# EasyEDA Pro project ProPrj_ESP-ARGB_2026-06-01.epro

# Schematic ESP-ARGB
Board Name: ESP-ARGB V1; Create Date: 2026-05-13; Page Name: P1; Project Name: ESP-ARGB; Schematic Name: ESP-ARGB; Update Date: 2026-05-25; Page Size: A4; Version: V1.0
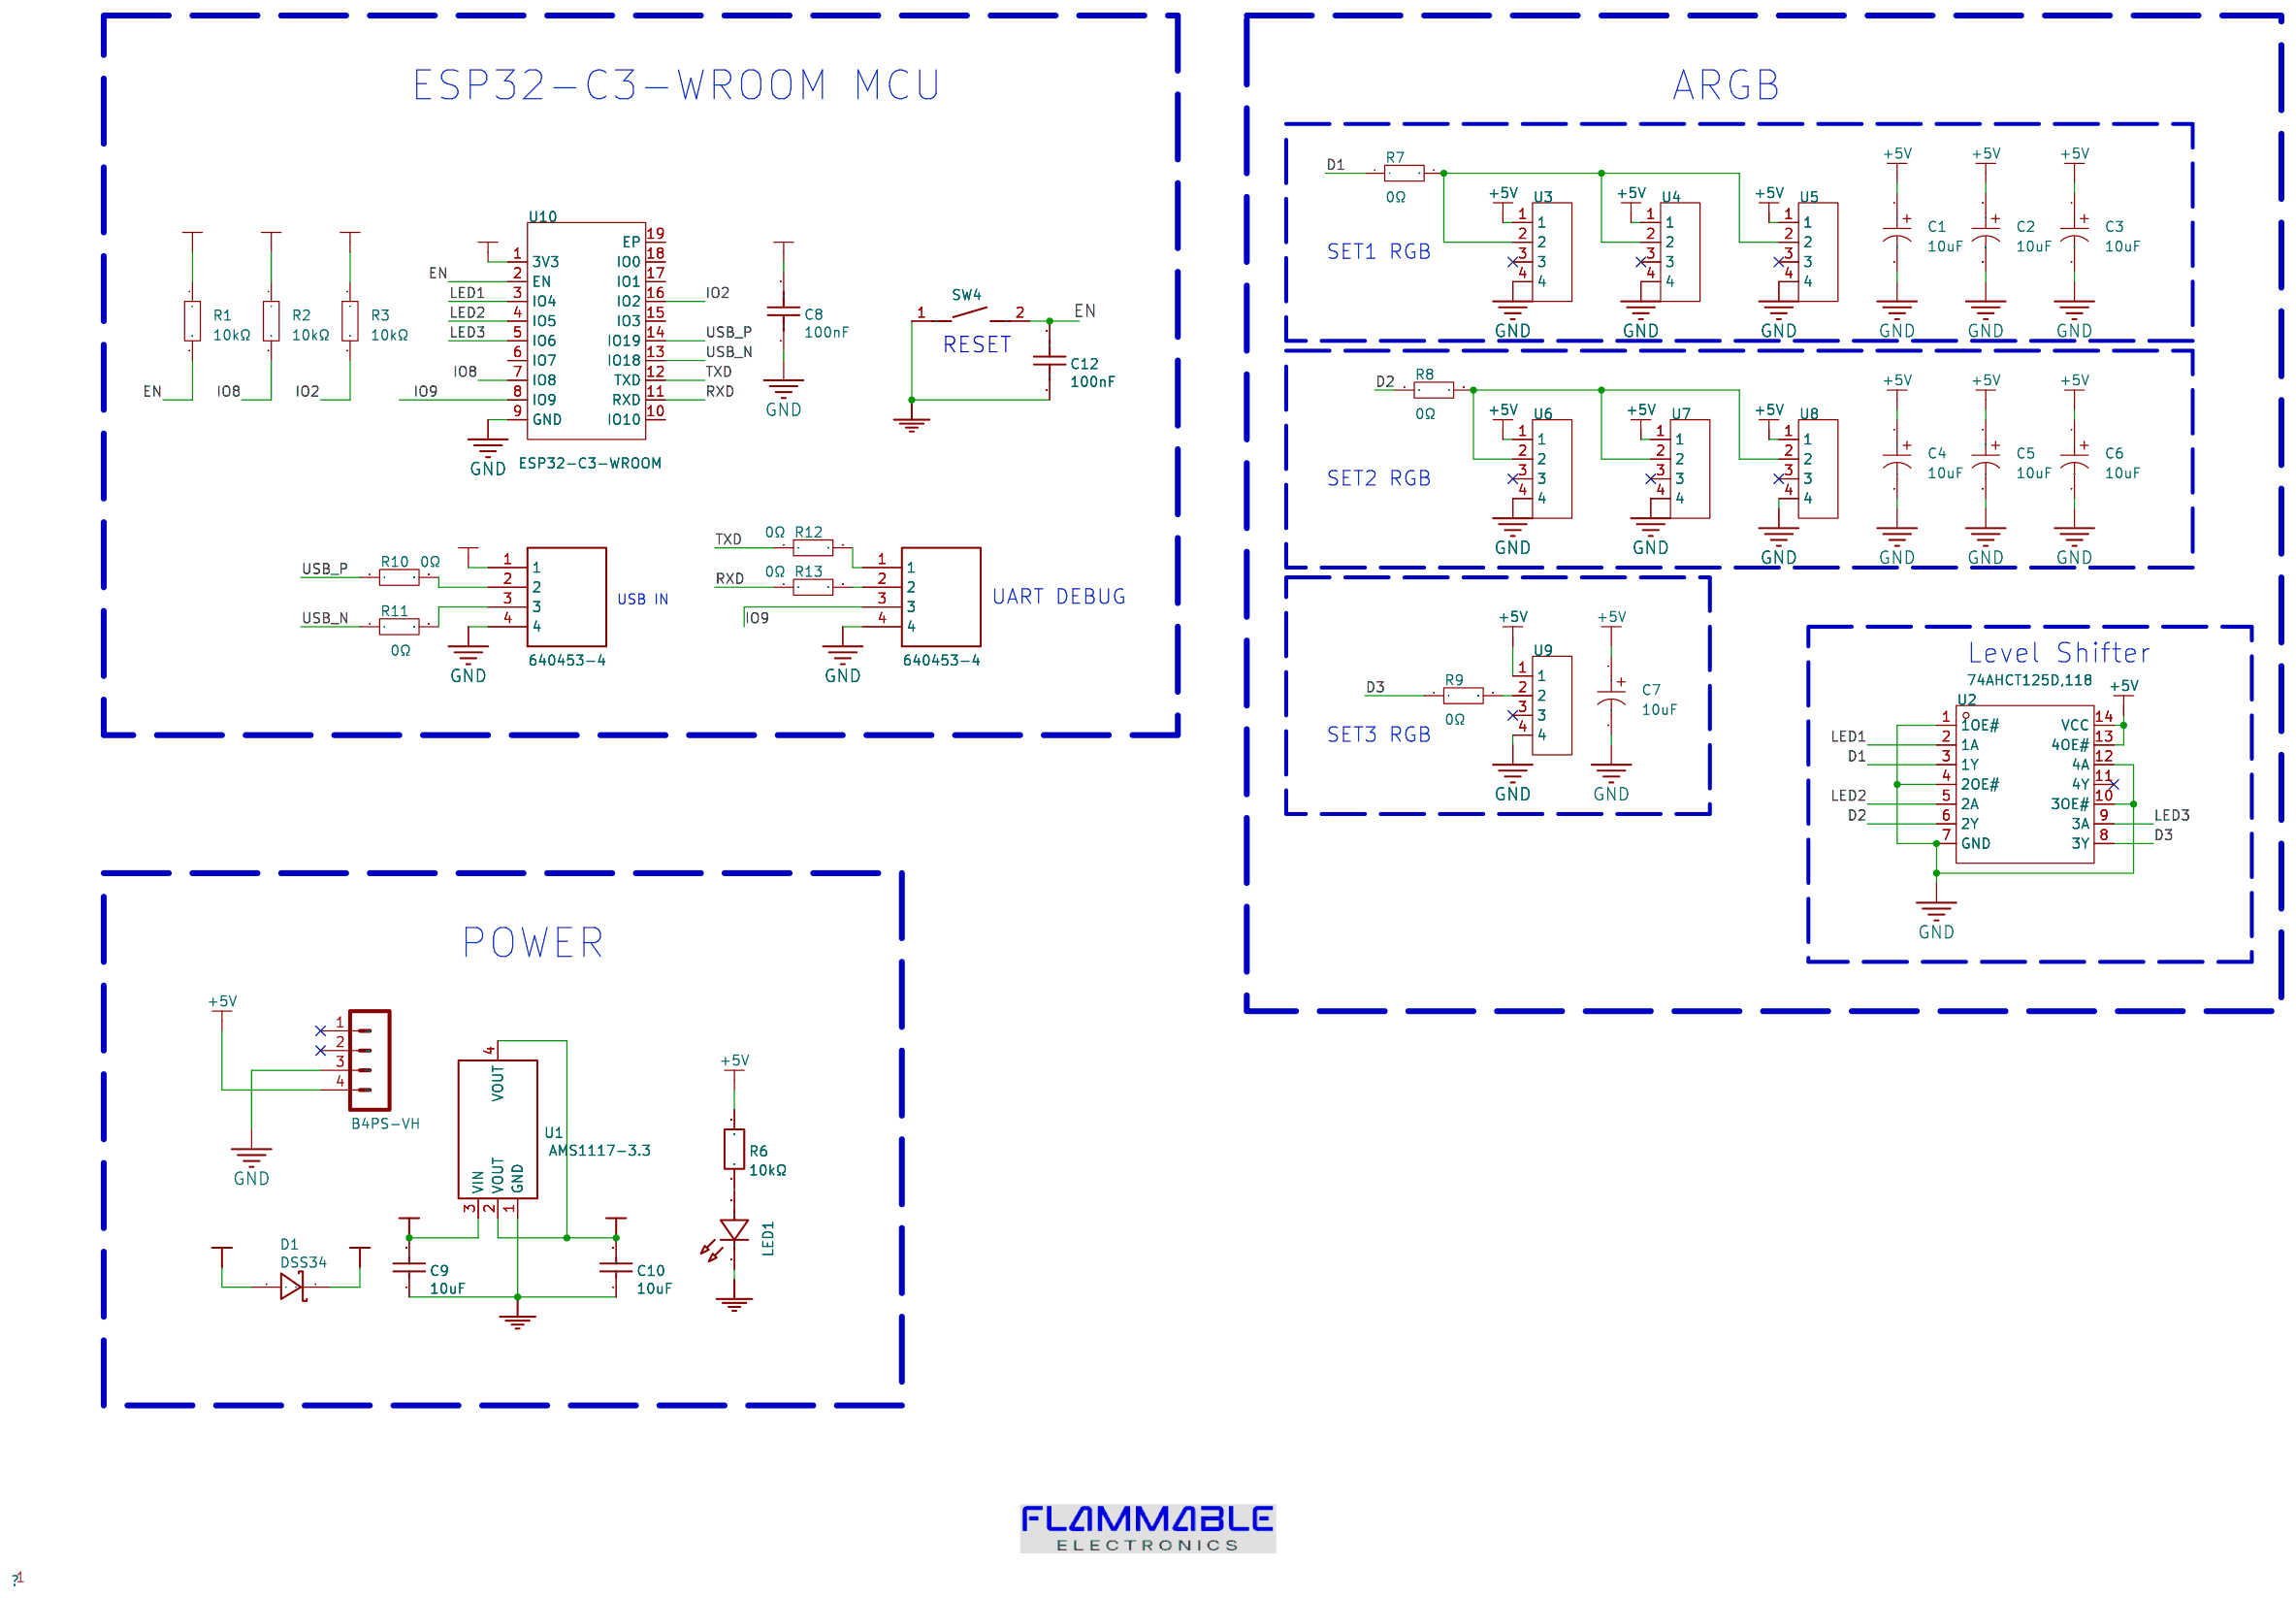
[diagram p0: schematic sheet]

## Parts
C1  10uF  [CAP-SMD_BD4.0-L4.3-W4.3-LS5.0-FD]
C2  10uF  [CAP-SMD_BD4.0-L4.3-W4.3-LS5.0-FD]
C3  10uF  [CAP-SMD_BD4.0-L4.3-W4.3-LS5.0-FD]
C4  10uF  [CAP-SMD_BD4.0-L4.3-W4.3-LS5.0-FD]
C5  10uF  [CAP-SMD_BD4.0-L4.3-W4.3-LS5.0-FD]
C6  10uF  [CAP-SMD_BD4.0-L4.3-W4.3-LS5.0-FD]
C7  10uF  [CAP-SMD_BD4.0-L4.3-W4.3-LS5.0-FD]
C8  100nF  [C0805]
C9  10uF  [C0805]
C10  10uF  [C0805]
C12  100nF  [C0805]
D1  DSS34  [SOD-123_L2.8-W1.8-LS3.7-RD]
LED1  SF-RED  [LED0805-RD_RED]
R1  10kΩ  [R0805]
R2  10kΩ  [R0805]
R3  10kΩ  [R0805]
R6  10kΩ  [R0805]
R7  0Ω  [R0805]
R8  0Ω  [R0805]
R9  0Ω  [R0805]
R10  0Ω  [R0805]
R11  0Ω  [R0805]
R12  0Ω  [R0805]
R13  0Ω  [R0805]
SW4  TS-1088-AR02016  [SW-SMD_L3.9-W3.0-P4.45]
U1  AMS1117-3.3  [SOT-223-3_L6.5-W3.4-P2.30-LS7.0-BR]
U2  74AHCT125D,118  [SOP-14_L8.6-W3.9-P1.27-LS6.0-BL]
U3  P125-1104A0BR138A1  [HDR-TH_4P-P2.54-H-M-W10.3]
U4  P125-1104A0BR138A1  [HDR-TH_4P-P2.54-H-M-W10.3]
U5  P125-1104A0BR138A1  [HDR-TH_4P-P2.54-H-M-W10.3]
U6  P125-1104A0BR138A1  [HDR-TH_4P-P2.54-H-M-W10.3]
U7  P125-1104A0BR138A1  [HDR-TH_4P-P2.54-H-M-W10.3]
U8  P125-1104A0BR138A1  [HDR-TH_4P-P2.54-H-M-W10.3]
U9  P125-1104A0BR138A1  [HDR-TH_4P-P2.54-H-M-W10.3]
U10  ESP32-C3-WROOM  [BULETM-SMD_ESPRESSIF_ESP32-C3-WROOM-02-N4-4MB]
U11  640453-4  [TE_640453-4]
U12  640453-4  [TE_640453-4]
X1  B4PS-VH  [B4PS-VH]

## Library data of the parts
C1-C7 = RVT1E100M0405 10UF 25V: Capacitance:10uF Tolerance:±20% Tolerance:±20% Voltage Rating:25V Ripple Current:15mA@120Hz Equivalent Series Resistance(ESR):- Diameter:4mm Height - Seated (Max):5.4mm Lifetime:2800hrs@105℃ Operating Temperature:-55℃~+105℃ Operating Temperature:-55℃~+105; LCSC Part Name: 10uF ±20% 25V; Supplier Part: C970655; Manufacturer: DMBJ(振宝佳); Supplier Footprint: SMD,D4xL5.4mm; JLCPCB Part Class: Extended Part; Datasheet: https://item.szlcsc.com/datasheet/RVT1E100M0405%252010UF%252025V/1060383.html; Supplier: LCSC; Tolerance: ±20%; Voltage Rating: 25V; Ripple Current: 15mA@120Hz; Diameter: 4mm; Height - Seated (Max): 5.4mm; Lifetime: 2800hrs@105℃; Operating Temperature: -55℃~+105℃
C8 C12 = 100nF: Supplier: LCSC; Manufacturer: TDK; Manufacturer Part: C2012X7R1H104KT0J0N; Supplier Part: C76644; JLCPCB Part Class: Extended Part; nameAlias: Value; spicePre: C; spiceSymbolName: C2012X7R1H104KT0J0N
C9 C10 = 10uF: Supplier: LCSC; Manufacturer Part: CL21A106KOQNNNE; Manufacturer: SAMSUNG(三星); Supplier Part: C1713; JLCPCB Part Class: Extended Part; nameAlias: Value; spicePre: C; spiceSymbolName: CL21A106KOQNNNE
D1 = DSS34: Supplier: LCSC; Manufacturer: 星海; Supplier Part: C84632; JLCPCB Part Class: Extended Part; spicePre: D
LED1 = SF-RED: Supplier: LCSC; Supplier Part: C9900020303; Manufacturer: null; Manufacturer Part: 0805 SF-Red; JLCPCB Part Class: Extended Part; Contributor: lcsc; spicePre: U; spiceSymbolName: 0805 SF-RED
R1-R3 = 0805W8F1002T5E: Type:Thick Film Resistor Resistance:10kΩ Tolerance:±1% Tolerance:±1% Power(Watts):125mW Voltage-Supply(Max):150V Temperature Coefficient:±100ppm/℃ Temperature Coefficient:±100ppm/℃ Operating Temperature:-55℃~+155℃ Operating Temperature:-55℃~+155℃; LCSC Part Name: 10kΩ ±1% 125mW 厚膜电阻; Supplier Part: C17414; Manufacturer: UNI-ROYAL(厚声); Supplier Footprint: 0805; Datasheet: https://item.szlcsc.com/datasheet/0805W8F1002T5E/18102.html; Supplier: LCSC; Type: Thick Film Resistor; Tolerance: ±1%; Power(Watts): 125mW; Voltage-Supply(Max): 150V; Temperature Coefficient: ±100ppm/℃; Operating Temperature: -55℃~+155℃
R6 = 10kΩ: Supplier: LCSC; Supplier Part: C2076274; Manufacturer: VISHAY(威世); Manufacturer Part: TNPW080510K0BETA; JLCPCB Part Class: Extended Part; nameAlias: Value; Contributor: lcsc; spicePre: R; spiceSymbolName: TNPW080510K0BETA
R7-R13 = 0805W8F0000T5E_C17477: Type:Thick Film Resistor Resistance:0Ω Tolerance:±1% Tolerance:±1% Power(Watts):125mW Voltage-Supply(Max):150V Temperature Coefficient:±800ppm/℃ Temperature Coefficient:±800ppm/℃ Operating Temperature:-55℃~+155℃ Operating Temperature:-55℃~+155℃; LCSC Part Name: 0Ω ±1% 125mW 厚膜电阻; Supplier Part: C17477; Manufacturer: UNI-ROYAL(厚声); Manufacturer Part: 0805W8F0000T5E; Supplier Footprint: 0805; Datasheet: https://item.szlcsc.com/datasheet/0805W8F0000T5E/18165.html; Supplier: LCSC; Type: Thick Film Resistor; Tolerance: ±1%; Power(Watts): 125mW; Voltage-Supply(Max): 150V; Temperature Coefficient: ±800ppm/℃; Operating Temperature: -55℃~+155℃
SW4 = TS-1088-AR02016: Supplier: LCSC; Supplier Part: C720477; Manufacturer: XUNPU(讯普); JLCPCB Part Class: Basic Part; Contributor: LCSC; spicePre: S
U1 = AMS1117-3.3: Supplier: LCSC; Manufacturer: AMS; Supplier Part: C6186; JLCPCB Part Class: Basic Part; sourceId: dwIGgezVh; timeStamp: 1476261164; spicePre: U
U2 = 74AHCT125D,118: Input type:Schmitt trigger output type:Tri-State Voltage - Supply:4.5V~5.5V Voltage - Supply:4.5V~5.5V Number of Elements:4 Number of Bits per Element:1 Channel Type:Unidirectional Current - Output Low(IOL):8mA Current - Output High(IOH):8mA Logic Family:; LCSC Part Name: 三态输出，四路缓冲器/线路驱动器; Supplier Part: C554502; Manufacturer: Nexperia(安世); Supplier Footprint: SOP-14; JLCPCB Part Class: Extended Part; Datasheet: https://item.szlcsc.com/datasheet/74AHCT125D%252C118/575616.html; Supplier: LCSC; Input type: Schmitt trigger; output type: Tri-State; Voltage - Supply: 4.5V~5.5V; Number of Elements: 4; Number of Bits per Element: 1; Channel Type: Unidirectional; Current - Output Low(IOL): 8mA; Current - Output High(IOH): 8mA; Logic Family: 74AHCT; Operating Temperature: -40℃~+125℃; Quiescent Current: 40uA; Propagation Delay: 4.3ns@5V,50pF
U3-U9 = P125-1104A0BR138A1: Pin Structure:1x4P Pitch:2.54mm Row Spacing:2.54mm Circluar Pins/Square Pins:Pin Header Mounting Type:Right Angle Number of Rows:1 Number of Pins:4P Current Rating:- Voltage Rating (Max):- Length of Mating Pin:6mm Insulation Height:2.5mm Length of End Con; LCSC Part Name: 1x4P 间距:2.54mm 方针 弯插; Supplier Part: C19190478; Manufacturer: Yxcon(宇熙精密); Supplier Footprint: 弯插,P=2.54mm; JLCPCB Part Class: Extended Part; Datasheet: https://item.szlcsc.com/datasheet/P125-1104A0BR138A1/20425800.html; Supplier: LCSC; Pin Structure: 1x4P; Pitch: 2.54mm; Row Spacing: 2.54mm; Circluar Pins/Square Pins: Pin Header; Mounting Type: Right Angle; Number of Rows: 1; Number of Pins: 4P; Length of Mating Pin: 6mm; Insulation Height: 2.5mm; Contact Material: Brass; Contact Plating: Gold; Operating Temperature: -40℃~+105℃; Color: Black
U10 = ESP32-C3-WROOM-02-N4_C2934560: Utilized IC / Part:ESP32-C3 Chip Wireless Standard:Bluetooth5.0 Interface Type:I2S；I2C；JTAG；UART；USB；SPI Frequency:2.4GHz Antenna Type:On-board PCB Antenna Output Power:20.5dBm Output Power:20.5dBm Voltage - Supply:3V~3.6V Voltage - Supply:3V~3.6V Receive; LCSC Part Name: 不带固件 2.4GHz Wi-Fi（802.11b/g/n）+ 蓝牙5模组; Supplier Part: C2934560; Manufacturer: ESPRESSIF(乐鑫); Manufacturer Part: ESP32-C3-WROOM-02-N4; Supplier Footprint: VFQFN-32-EP; Datasheet: https://item.szlcsc.com/datasheet/ESP32-C3-WROOM-02-N4/3281215.html; Supplier: LCSC; Utilized IC / Part: ESP32-C3 Chip; Wireless Standard: Bluetooth5.0; Interface Type: I2S；I2C；JTAG；UART；USB；SPI; Antenna Type: On-board PCB Antenna; Output Power: 20.5dBm; Voltage - Supply: 3V~3.6V; Receive  Current: 82mA; Send  Current: 345mA; Sensitivity: -105dBm; Operating Temperature: -40℃~+85℃
U11 U12 = 640453-4
X1 = B4PS-VH: MF: JST Sales; Package1: None; Price: None; SnapEDA_Link: https://www.snapeda.com/parts/B4PS-VH/JST/view-part/?ref=snap; Availability: In Stock; Check_prices: https://www.snapeda.com/parts/B4PS-VH/JST/view-part/?ref=eda

## Nets
+3.3V: C8.2 C10.2 R1.1 R2.1 R3.1 U1.2(VOUT) U1.4(VOUT) U10.1(3V3)
+5V: C1.1 C2.1 C3.1 C4.1 C5.1 C6.1 C7.1 C9.2 D1.1(K) R6.2 U1.3(VIN) U2.13(4OE#) U2.14(VCC) U3.1 U4.1 U5.1 U6.1 U7.1 U8.1 U9.1 X1.4
GND: C1.2 C2.2 C3.2 C4.2 C5.2 C6.2 C7.2 C8.1 C9.1 C10.1 C12.1 LED1.1(K) SW4.1 U1.1(GND) U2.1(1OE#) U2.4(2OE#) U2.7(GND) U2.10(3OE#) U2.12(4A) U3.4 U4.4 U5.4 U6.4 U7.4 U8.4 U9.4 U10.9(GND) U11.4 U12.4 X1.3
VBUS: D1.2(A) U11.1
D1: R7.1 U2.3(1Y)
D2: R8.1 U2.6(2Y)
D3: R9.1 U2.8(3Y)
EN: C12.2 R1.2 SW4.2 U10.2(EN)
IO2: R3.2 U10.16(IO2)
IO8: R2.2 U10.7(IO8)
IO9: U10.8(IO9) U12.3
LED1: U2.2(1A) U10.3(IO4)
LED2: U2.5(2A) U10.4(IO5)
LED3: U2.9(3A) U10.5(IO6)
RXD: R13.1 U10.11(RXD)
TXD: R12.1 U10.12(TXD)
USB_N: R11.1 U10.13(IO18)
USB_P: R10.1 U10.14(IO19)
$1N1605: R7.2 U3.2 U4.2 U5.2
$1N1629: R8.2 U6.2 U7.2 U8.2
$1N5231: LED1.2(A) R6.1
$1N5490: R9.2 U9.2
$1N5614: R11.2 U11.3
$1N5618: R10.2 U11.2
$1N5718: R12.2 U12.1
$1N5757: R13.2 U12.2

Not connected (* = marked no-connect by the designer): U2 11(4Y)*; U3 3*; U4 3*; U5 3*; U6 3*; U7 3*; U8 3*; U9 3*; U10 6(IO7) 10(IO10) 15(IO3) 17(IO1) 18(IO0) 19(EP); X1 1* 2*

## Notes on the sheet
- ESP32-C3-WROOM MCU
- ARGB
- SET1 RGB
- RESET
- SET2 RGB
- USB IN
- UART DEBUG
- Level Shifter
- SET3 RGB
- POWER

# Board PCB1
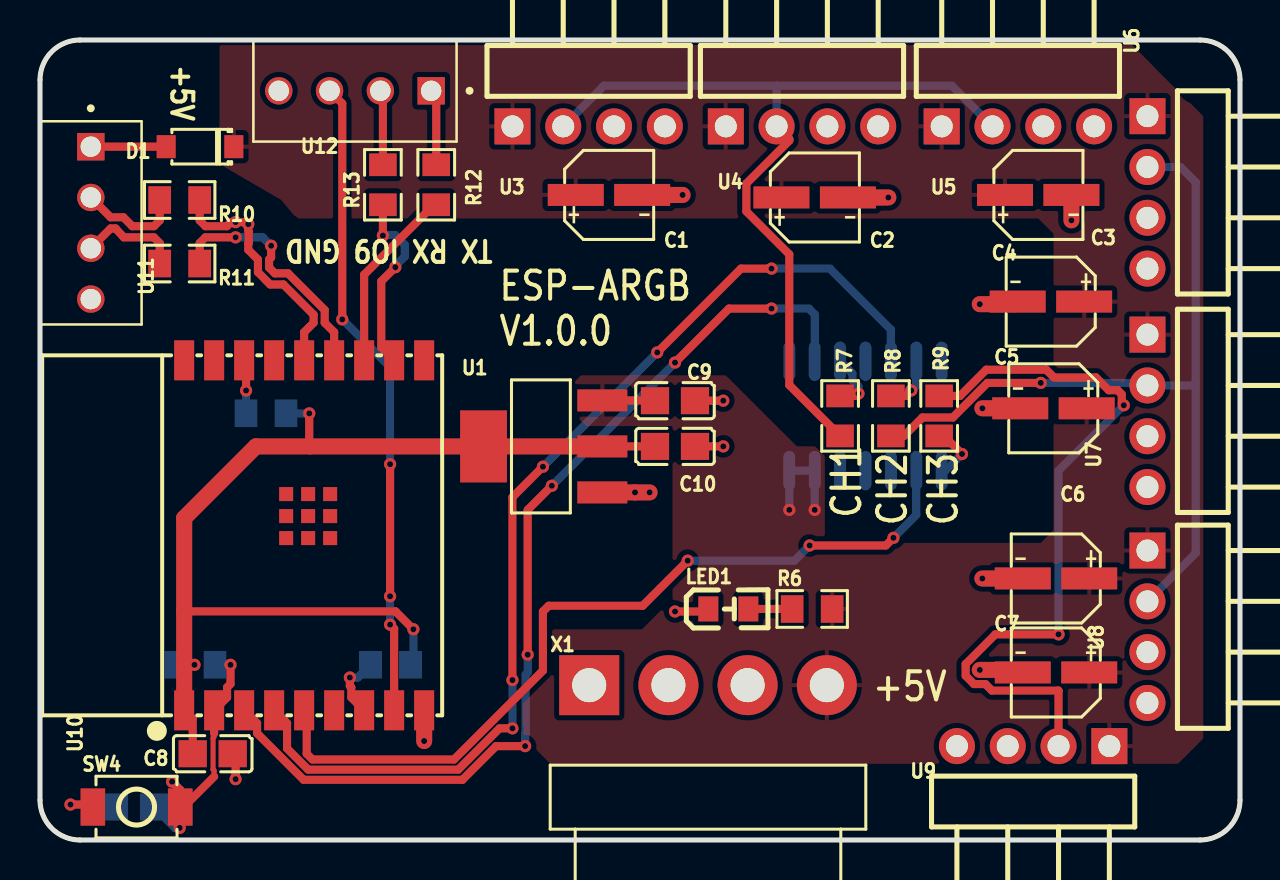
[diagram p1: board, top side]
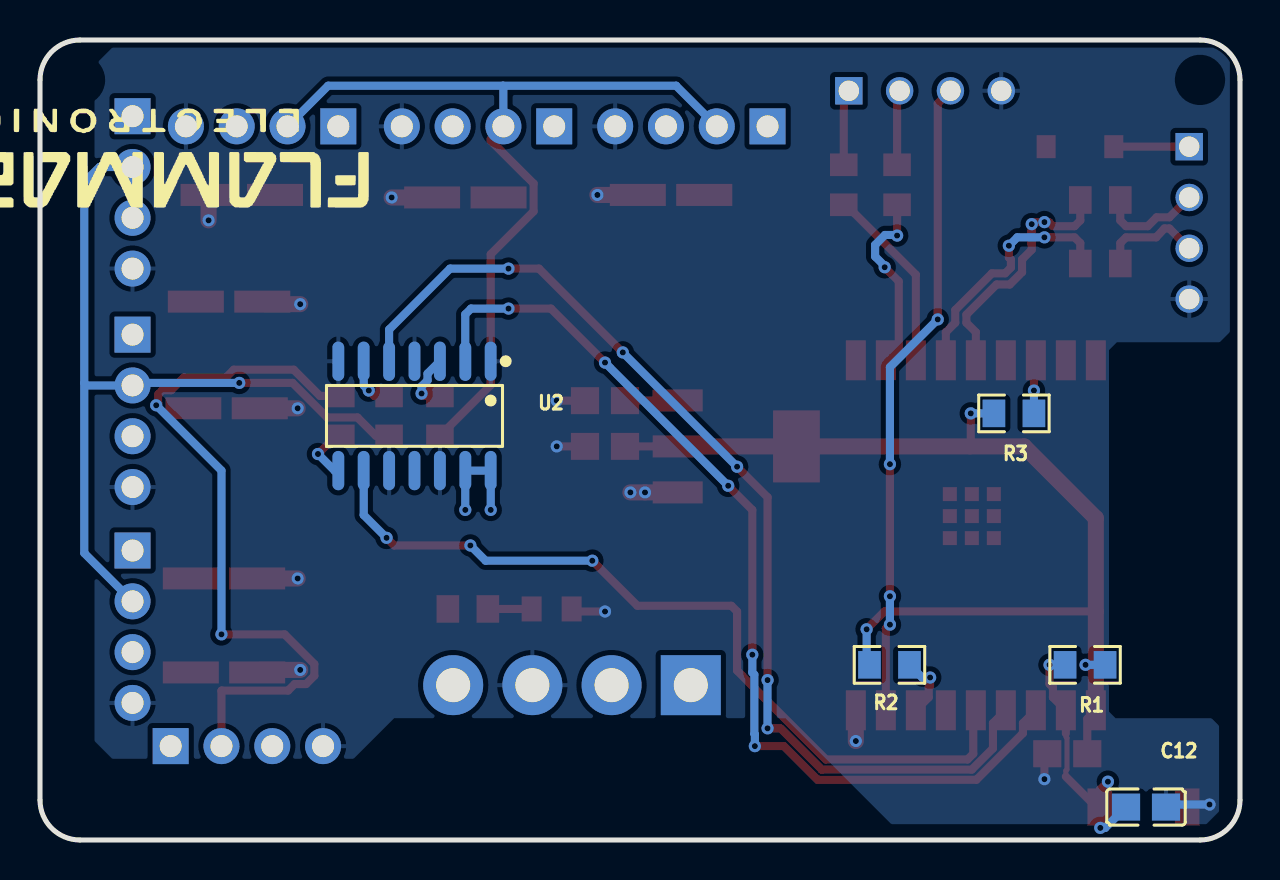
[diagram p2: board, bottom side, seen from below]

Outline 60 x 40 mm; copper layers: Top Layer, Bottom Layer. Coordinates in mm from the lower left corner of the outline.
Outline path: 0,38 0,2 arc(0.59,0.59) 2,0 58,0 arc(59.41,0.59) 60,2 60,38 arc(59.41,39.41) 58,40 2,40 arc(0.59,39.41) 0,38
Stack: Top Layer 0.035mm / Dielectric1 1.51mm FR4 er 4.5 / Bottom Layer 0.035mm

## Design rules (mm)
net $1N5618: DP2
net USB_P: DP1
net $1N5614: DP2
net USB_N: DP1
template: Custom Config
spacing copperThickness1oz (default): track to track 0.102, other pairs 0.152 to 0.3
spacing copperThickness2oz: track to track 0.203, other pairs 0.152 to 0.3
track width copperThickness1oz (default): min 0.127, default 0.254, max 2.54
track width copperThickness2oz: min 0.203, default 0.254, max 2.54
differential pair differentialPair (default): width min 0.127, default 0.254, max 2.54; gap min 0.152, default 0.152
via viaSize (default): diameter min 0.5, default 0.61, max 10; hole min 0.3, default 0.305, max 6.3
pour e46 uses copperRegion

## Placement (name value [footprint] x y rotation side)
C1  10uF  [CAP-SMD_BD4.0-L4.3-W4.3-LS5.0-FD]  28.45 32.25 0 top
C2  10uF  [CAP-SMD_BD4.0-L4.3-W4.3-LS5.0-FD]  38.73 32.13 0 top
C3  10uF  [CAP-SMD_BD4.0-L4.3-W4.3-LS5.0-FD]  49.91 32.25 0 top
C4  10uF  [CAP-SMD_BD4.0-L4.3-W4.3-LS5.0-FD]  50.55 26.92 180 top
C5  10uF  [CAP-SMD_BD4.0-L4.3-W4.3-LS5.0-FD]  50.67 21.58 180 top
C6  10uF  [CAP-SMD_BD4.0-L4.3-W4.3-LS5.0-FD]  50.8 13.08 180 top
C7  10uF  [CAP-SMD_BD4.0-L4.3-W4.3-LS5.0-FD]  50.8 8.38 180 top
C8  100nF  [C0805]  8.64 4.31 180 top
C9  10uF  [C0805]  31.75 21.97 180 top
C10  10uF  [C0805]  31.75 19.68 180 top
C12  100nF  [C0805]  4.7 1.65 0 bottom
D1  DSS34  [SOD-123_L2.8-W1.8-LS3.7-RD]  8 34.67 180 top
LED1  SF-RED  [LED0805-RD_RED]  34.42 11.55 0 top
R1  10kΩ  [R0805]  7.75 8.76 0 bottom
R2  10kΩ  [R0805]  17.53 8.76 180 bottom
R3  10kΩ  [R0805]  11.3 21.33 180 bottom
R6  10kΩ  [R0805]  38.61 11.55 0 top
R7  0Ω  [R0805]  40.01 21.2 270 top
R8  0Ω  [R0805]  42.55 21.2 270 top
R9  0Ω  [R0805]  44.96 21.2 90 top
R10  0Ω  [R0805]  6.98 32 180 top
R11  0Ω  [R0805]  6.98 28.82 180 top
R12  0Ω  [R0805]  19.81 32.76 90 top
R13  0Ω  [R0805]  17.14 32.76 90 top
SW4  TS-1088-AR02016  [SW-SMD_L3.9-W3.0-P4.45]  4.83 1.65 0 top
U1  AMS1117-3.3  [SOT-223-3_L6.5-W3.4-P2.30-LS7.0-BR]  25.15 19.68 0 top
U2  74AHCT125D,118  [SOP-14_L8.6-W3.9-P1.27-LS6.0-BL]  41.27 21.2 0 bottom
U3  P125-1104A0BR138A1  [HDR-TH_4P-P2.54-H-M-W10.3]  27.43 35.68 0 top
U4  P125-1104A0BR138A1  [HDR-TH_4P-P2.54-H-M-W10.3]  38.1 35.68 0 top
U5  P125-1104A0BR138A1  [HDR-TH_4P-P2.54-H-M-W10.3]  48.89 35.68 0 top
U6  P125-1104A0BR138A1  [HDR-TH_4P-P2.54-H-M-W10.3]  55.37 32.38 270 top
U7  P125-1104A0BR138A1  [HDR-TH_4P-P2.54-H-M-W10.3]  55.37 21.46 270 top
U8  P125-1104A0BR138A1  [HDR-TH_4P-P2.54-H-M-W10.3]  55.37 10.66 270 top
U9  P125-1104A0BR138A1  [HDR-TH_4P-P2.54-H-M-W10.3]  49.66 4.69 180 top
U10  ESP32-C3-WROOM  [BULETM-SMD_ESPRESSIF_ESP32-C3-WROOM-02-N4-4MB]  13.21 15.23 90 top
U11  640453-4  [TE_640453-4]  2.54 34.67 270 top
U12  640453-4  [TE_640453-4]  19.56 37.46 180 top
X1  -  [B4PS-VH]  33.4 7.74 0 top

## Footprints (pads in the part's own frame, mm; a bottom-side part is the same pattern mirrored in y, then rotated)
B4PS-VH
  rect 3x3 hole 1.7: 1(-5.94,0)
  round 3 hole 1.7: 2(-1.98,0) 3(1.98,0) 4(5.94,0)
BULETM-SMD_ESPRESSIF_ESP32-C3-WROOM-02-N4-4MB
  rect 2x1 smd: 1(-8.75,6) 2(-8.75,4.5) 3(-8.75,3) 4(-8.75,1.5) 5(-8.75,0) 6(-8.75,-1.5) 7(-8.75,-3) 8(-8.75,-4.5) 9(-8.75,-6) 10(8.75,-6) 11(8.75,-4.5) 12(8.75,-3) 13(8.75,-1.5) 14(8.75,0) 15(8.75,1.5) 16(8.75,3) 17(8.75,4.5) 18(8.75,6)
  rect 0.7x0.7 smd: 19(-0.14,0.9) 19(-0.14,-0.2) 19(-0.14,-1.3) 19(0.96,0.9) 19(0.96,-0.2) 19(0.96,-1.3) 19(2.06,0.9) 19(2.06,-0.2) 19(2.06,-1.3)
C0805
  rect 1.41x1.35 smd: 1(-1,0) 2(1,0)
CAP-SMD_BD4.0-L4.3-W4.3-LS5.0-FD
  rect 2.8x1.1 smd: 1(-1.661,0) 2(1.661,0)
HDR-TH_4P-P2.54-H-M-W10.3
  rect 1.8x1.8 hole 1.1: 1(-3.81,0)
  round 1.8 hole 1.1: 2(-1.27,0) 3(1.27,0) 4(3.81,0)
LED0805-RD_RED
  rect 1x1.25 smd: 1(-1,0) 2(1,0)
R0805
  rect 1.133x1.377 smd: 1(-1,0) 2(1,0)
SOD-123_L2.8-W1.8-LS3.7-RD
  rect 0.95x1.15 smd: 1(-1.692,0) 2(1.692,0)
SOP-14_L8.6-W3.9-P1.27-LS6.0-BL
  oval 0.595x1.968 smd: 1(-3.81,-2.734) 2(-2.54,-2.734) 3(-1.27,-2.734) 4(0,-2.734) 5(1.27,-2.734) 6(2.54,-2.734) 7(3.81,-2.734) 8(3.81,2.734) 9(2.54,2.734) 10(1.27,2.734) 11(0,2.734) 12(-1.27,2.734) 13(-2.54,2.734) 14(-3.81,2.734)
SOT-223-3_L6.5-W3.4-P2.30-LS7.0-BR
  rect 2.5x1.1 smd: 1(2.97,-2.3) 2(2.97,0) 3(2.97,2.3)
  rect 2.34x3.6 smd: 4(-2.97,0)
SW-SMD_L3.9-W3.0-P4.45
  rect 1.23x1.86 smd: 1(-2.185,0) 2(2.185,0)
TE_640453-4
  rect 1.37x1.37 hole 1.02: 1(0,0)
  round 1.37 hole 1.02: 2(2.54,0) 3(5.08,0) 4(7.62,0)

## Nets
As in the schematic.

Pads without a net: U2 11; U3 3; U4 3; U5 3; U6 3; U7 3; U8 3; U9 3; U10 6 10 15 17 18 19; X1 1 2

## Via types
v1: diameter 0.61, hole 0.305, Top Layer to Bottom Layer, 54 vias

## Routing (per net, layer and track width the routed paths; a pad name or vN(x,y) marks a point on that pad's centre or on a via; arc(x,y) is an arc through that point)
+3.3V: length 55
  Top Layer w0.406: 7.21,11.43 17.77,11.43 v1(18.67,10.54) ; C8.2 7.64,6.06 U10.1 ; 13.49,19.68 13.46,19.7 v1(13.46,21.33) ; 7.21,8.75 7.22,8.76 v1(7.72,8.76) ; U1.2 C10.2
  Top Layer w0.803: U1.2 U1.4 10.8,19.68 7.21,16.09 U10.1
  Bottom Layer w0.406: v1(7.72,8.76) R1.1 ; v1(18.67,10.54) 18.67,8.9 R2.1 ; R3.1 v1(13.46,21.33)
+5V: length 7.8
  Top Layer w0.406: C9.2 30.74,21.98 U1.3
  Bottom Layer w0.406: v1(37.47,16.5) U2.14 U2.13 v1(38.73,16.5)
GND: length 26.6
  Top Layer w0.406: v1(31.75,11.42) 33.29,11.42 LED1.1 ; C10.1 v1(34.16,19.68) ; v1(1.52,1.77) 2.51,1.77 SW4.1 ; v1(9.78,3.04) 9.78,4.17 C8.1 ; C9.1 v1(34.16,21.97)
  Top Layer w0.803: v1(46.99,8.5) 49.01,8.5 C7.2 ; v1(30.48,17.38) v1(29.75,17.38) U1.1 ; C4.2 48.76,26.79 v1(46.99,26.79) ; C1.2 v1(32.13,32.25) ; C5.2 v1(47.12,21.58) ; C2.2 v1(42.42,32.13) ; U10.9 v1(19.21,4.95) ; C6.2 v1(47.12,13.08) ; C3.2 v1(51.57,30.98)
  Bottom Layer w0.406: C12.1 3.57,1.77 v1(1.52,1.77)
VBUS: length 3.8
  Top Layer w0.406: D1.2 U11.1
D1: length 3
  Top Layer w0.406: R7.1 40.8,22.2 v1(40.92,22.32)
  Bottom Layer w0.406: U2.3 40.62,23.32 40.62,22.98 40.92,22.68 v1(40.92,22.32)
D2: length 2.7
  Top Layer w0.406: v1(43.56,22.47) 43.29,22.2 R8.1
  Bottom Layer w0.406: U2.6 43.82,22.73 v1(43.56,22.47)
D3: length 2.9
  Top Layer w0.406: R9.1 45.2,20.2 v1(46.1,19.3)
  Bottom Layer w0.406: v1(46.1,19.3) 45.27,18.47 U2.8
EN: length 13.1
  Top Layer w0.254: 8.71,3.17 8.71,3.47 8.65,3.52 8.65,5.1 8.71,5.16
  Top Layer w0.406: SW4.2 7.18,1.65 8.71,3.17 ; SW4.2 7.01,0.63 v1(6.98,0.6) ; SW4.2 7.01,2.51 v1(6.6,2.92) ; v1(9.52,8.76) 9.52,7.8 9.35,7.63 9.35,7.13 U10.2 8.71,5.33
  Bottom Layer w0.406: C12.2 6.74,0.6 v1(6.98,0.6) ; R1.2 v1(9.52,8.76)
IO2: length 2.7
  Top Layer w0.406: U10.16 10.3,23.89 v1(10.3,22.47)
  Bottom Layer w0.406: R3.2 v1(10.3,22.47)
IO8: length 3.2
  Top Layer w0.406: U10.7 15.56,7.13 15.56,7.63 15.49,7.7 v1(15.49,8.12)
  Bottom Layer w0.406: v1(15.49,8.12) 15.89,8.12 R2.2
IO9: length 32.3
  Top Layer w0.406: v1(17.5,12.19) v1(17.5,18.79) ; v1(15.11,26.03) 15.11,36.82 U12.3 ; v1(17.5,10.77) 17.71,10.56 U10.8
  Bottom Layer w0.406: v1(17.5,18.79) 17.5,23.64 v1(15.11,26.03) ; v1(17.5,10.77) v1(17.5,12.19)
LED1: length 49.3
  Top Layer w0.406: v1(24.26,4.69) 22.81,4.69 21.12,3.01 13.18,3.01 10.85,5.34 10.85,5.84 U10.3 ; v1(24.38,9.27) 24.38,16.5 v1(25.59,17.71) ; v1(36.58,26.57) 34.45,26.57 v1(31.75,23.87)
  Bottom Layer w0.406: v1(24.38,9.27) 24.38,8.37 24.28,8.27 24.28,5.31 24.26,5.28 v1(24.26,4.69) ; v1(25.59,17.71) v1(31.75,23.87) ; v1(36.58,26.57) 38.45,26.57 38.73,26.28 U2.2
LED2: length 52.8
  Top Layer w0.406: v1(23.62,5.58) 22.98,5.58 20.91,3.52 13.41,3.52 12.35,4.58 12.35,5.84 U10.4 ; v1(23.62,8) 23.62,17.14 v1(25.15,18.66) ; v1(30.86,24.38) 35.05,28.57 v1(36.58,28.57)
  Bottom Layer w0.406: v1(36.58,28.57) 39.5,28.57 42.55,25.52 U2.5 ; v1(23.62,5.58) v1(23.62,8) ; v1(25.15,18.66) v1(30.86,24.38)
LED3: length 41.8
  Top Layer w0.406: U10.5 13.33,6.36 13.33,4.31 13.62,4.03 20.7,4.03 25.15,8.47 25.15,11.42 25.43,11.71 30.13,11.71 v1(32.39,13.96) ; v1(42.67,15.11) 42.29,14.73 v1(38.48,14.73)
  Bottom Layer w0.406: v1(38.48,14.73) 37.72,13.96 v1(32.39,13.96) ; v1(42.67,15.11) 43.82,16.25 U2.9
RXD: length 9.4
  Top Layer w0.406: v1(17.77,28.64) 17.06,27.94 17.06,24.63 U10.11 ; v1(17.14,30.22) R13.1
  Bottom Layer w0.406: v1(17.77,28.64) 17.77,28.7 18.24,29.18 18.24,29.76 17.75,30.25 17.18,30.25 v1(17.14,30.22)
TXD: length 9.3
  Top Layer w0.406: U10.12 16.21,28.27 19.7,31.76 R12.1
USB_N: length 12.4
  Top Layer w0.406: U10.13 14.71,25.39 14.24,25.86 14.24,26.5 12.4,28.33 11.74,28.33 11.45,28.62 11.45,29.03 11.56,29.13 v1(11.56,29.71) ; R11.1 7.98,29.84 8.27,30.13 v1(9.78,30.13)
  Bottom Layer w0.406: v1(11.56,29.71) 11.14,30.13 v1(9.78,30.13)
USB_P: length 12.5
  Top Layer w0.406: R10.1 7.98,30.98 8.27,30.69 9.34,30.69 9.55,30.89 v1(9.78,30.89) 10.31,30.89 v1(10.41,30.79) 10.41,30.43 10.44,30.41 10.44,29.86 10.41,29.83 10.41,29.51 10.9,29.03 10.9,28.39 11.51,27.78 12.17,27.78 13.68,26.27 13.68,25.86 13.21,25.39 U10.14
$1N1605: length 43.8
  Top Layer w0.406: U4.2 37.47,35.05 37.47,34.97 35.32,32.82 35.32,31.43 37.47,29.28 37.47,22.74 R7.2
  Bottom Layer w0.406: 36.85,37.71 45.59,37.71 U5.2 ; 36.85,37.71 28.19,37.71 U3.2 ; 36.85,37.71 36.83,37.69 U4.2
$1N1629: length 41.1
  Top Layer w0.406: v1(50.04,22.85) 47.37,22.85 45.64,21.13 44.12,21.13 43.2,20.2 R8.2
  Bottom Layer w0.406: 57.79,22.84 57.79,14.35 U8.2 ; 57.79,22.84 57.67,22.73 U7.2 55.25,22.85 v1(50.04,22.85) ; 57.79,22.84 57.79,32.89 57.02,33.65 U6.2
$1N5231: length 2.2
  Top Layer w0.406: LED1.2 R6.1
$1N5490: length 37.1
  Top Layer w0.406: R9.2 46,22.2 47.31,23.52 50.31,23.52 50.7,23.13 52.8,23.13 53.44,22.49 53.88,22.49 54.09,22.28 54.09,21.84 v1(54.19,21.74) ; v1(50.93,10.28) 47.77,10.28 46.28,8.8 46.28,8.21 46.7,7.8 47.27,7.8 47.59,7.47 50.91,7.47 50.93,7.46 U9.2
  Bottom Layer w0.406: v1(50.93,10.28) 50.93,18.47 v1(54.19,21.74)
$1N5614: length 5.2
  Top Layer w0.406: U11.3 3.53,30.58 3.78,30.58 4.19,30.13 5.7,30.13 5.98,29.84 R11.2
$1N5618: length 5.2
  Top Layer w0.406: U11.2 3.53,31.13 4.17,31.13 4.61,30.69 5.7,30.69 5.98,30.98 R10.2
$1N5718: length 3.8
  Top Layer w0.406: U12.1 19.81,37.21 R12.2
$1N5757: length 3.8
  Top Layer w0.406: R13.2 17.14,37.33 U12.2

## Copper pours and planes (outline as drawn; the poured copper is in the pictures)
+5V on Top Layer: 8.97,40 54.36,40 58.17,36.19 58.17,5.07 56.9,3.8 25.53,3.8 24.13,5.2 24.13,9.14 25.53,10.54 30.1,10.54 31.62,12.06 31.62,20.7 27.3,20.7 26.67,21.33 26.67,22.85 27.05,23.24 34.29,23.24 37.84,19.68 38.76,19.68 39.24,19.19 39.24,14.85 50.04,14.85 50.67,15.49 50.67,30.32 49.91,31.08 12.95,31.08 12.7,31.24 12.07,32 8.97,33.8
GND on Bottom Layer: 0.51,25.39 1.02,24.89 6.16,24.89 6.55,24.49 6.55,6.42 6.22,6.09 1.43,6.09 1.04,5.71 1.04,1.43 1.68,0.79 17.43,0.79 22.73,6.09 42.29,6.09 44.32,4.06 56.39,4.06 57.28,4.95 57.28,38.73 56.39,39.62 1.16,39.62 0.51,38.97

## Text on the board
Top Silkscreen Layer: TX RX IO9 GND | +5V | ESP-ARGB / V1.0.0 | CH1 | CH2 | CH3
